# EAGLE schematic ProtoPass (EAGLE 9.0.1)
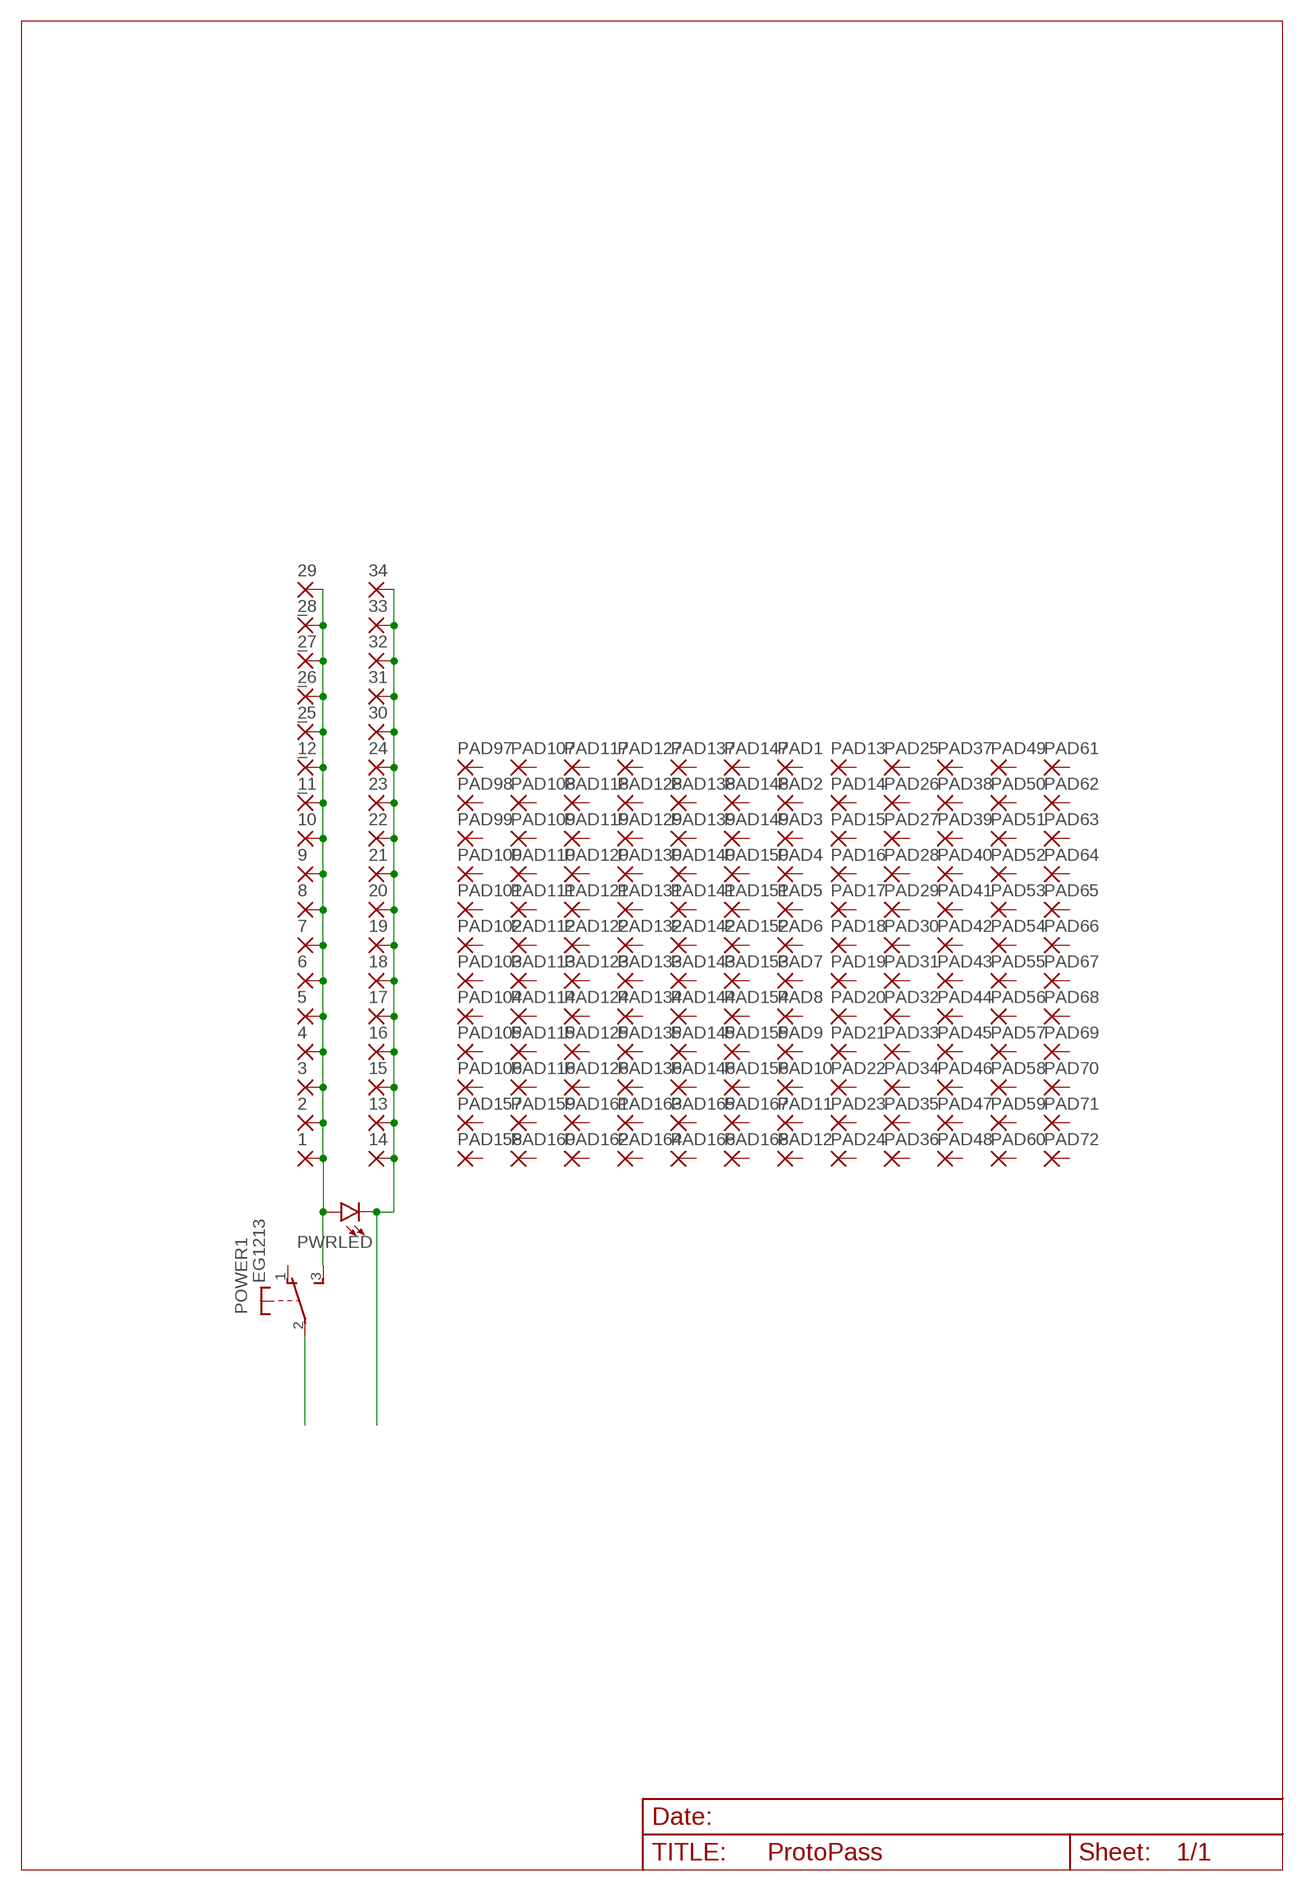
[diagram p0: schematic, sheet 1]

## Parts
1  1,6/0,9  [1,6/0,9]
2  1,6/0,9  [1,6/0,9]
3  1,6/0,9  [1,6/0,9]
4  1,6/0,9  [1,6/0,9]
5  1,6/0,9  [1,6/0,9]
6  1,6/0,9  [1,6/0,9]
7  1,6/0,9  [1,6/0,9]
8  1,6/0,9  [1,6/0,9]
9  1,6/0,9  [1,6/0,9]
10  1,6/0,9  [1,6/0,9]
11  1,6/0,9  [1,6/0,9]
12  _  1,6/0,9  [1,6/0,9]
13  1,6/0,9  [1,6/0,9]
14  1,6/0,9  [1,6/0,9]
15  1,6/0,9  [1,6/0,9]
16  1,6/0,9  [1,6/0,9]
17  1,6/0,9  [1,6/0,9]
18  1,6/0,9  [1,6/0,9]
19  1,6/0,9  [1,6/0,9]
20  1,6/0,9  [1,6/0,9]
21  1,6/0,9  [1,6/0,9]
22  1,6/0,9  [1,6/0,9]
23  1,6/0,9  [1,6/0,9]
24  1,6/0,9  [1,6/0,9]
25  _  1,6/0,9  [1,6/0,9]
26  _  1,6/0,9  [1,6/0,9]
27  _  1,6/0,9  [1,6/0,9]
28  _  1,6/0,9  [1,6/0,9]
29  _  1,6/0,9  [1,6/0,9]
30  1,6/0,9  [1,6/0,9]
31  1,6/0,9  [1,6/0,9]
32  1,6/0,9  [1,6/0,9]
33  1,6/0,9  [1,6/0,9]
34  1,6/0,9  [1,6/0,9]
PAD1  1,6/0,9  [1,6/0,9]
PAD2  1,6/0,9  [1,6/0,9]
PAD3  1,6/0,9  [1,6/0,9]
PAD4  1,6/0,9  [1,6/0,9]
PAD5  1,6/0,9  [1,6/0,9]
PAD6  1,6/0,9  [1,6/0,9]
PAD7  1,6/0,9  [1,6/0,9]
PAD8  1,6/0,9  [1,6/0,9]
PAD9  1,6/0,9  [1,6/0,9]
PAD10  1,6/0,9  [1,6/0,9]
PAD11  1,6/0,9  [1,6/0,9]
PAD12  1,6/0,9  [1,6/0,9]
PAD13  1,6/0,9  [1,6/0,9]
PAD14  1,6/0,9  [1,6/0,9]
PAD15  1,6/0,9  [1,6/0,9]
PAD16  1,6/0,9  [1,6/0,9]
PAD17  1,6/0,9  [1,6/0,9]
PAD18  1,6/0,9  [1,6/0,9]
PAD19  1,6/0,9  [1,6/0,9]
PAD20  1,6/0,9  [1,6/0,9]
PAD21  1,6/0,9  [1,6/0,9]
PAD22  1,6/0,9  [1,6/0,9]
PAD23  1,6/0,9  [1,6/0,9]
PAD24  1,6/0,9  [1,6/0,9]
PAD25  1,6/0,9  [1,6/0,9]
PAD26  1,6/0,9  [1,6/0,9]
PAD27  1,6/0,9  [1,6/0,9]
PAD28  1,6/0,9  [1,6/0,9]
PAD29  1,6/0,9  [1,6/0,9]
PAD30  1,6/0,9  [1,6/0,9]
PAD31  1,6/0,9  [1,6/0,9]
PAD32  1,6/0,9  [1,6/0,9]
PAD33  1,6/0,9  [1,6/0,9]
PAD34  1,6/0,9  [1,6/0,9]
PAD35  1,6/0,9  [1,6/0,9]
PAD36  1,6/0,9  [1,6/0,9]
PAD37  1,6/0,9  [1,6/0,9]
PAD38  1,6/0,9  [1,6/0,9]
PAD39  1,6/0,9  [1,6/0,9]
PAD40  1,6/0,9  [1,6/0,9]
PAD41  1,6/0,9  [1,6/0,9]
PAD42  1,6/0,9  [1,6/0,9]
PAD43  1,6/0,9  [1,6/0,9]
PAD44  1,6/0,9  [1,6/0,9]
PAD45  1,6/0,9  [1,6/0,9]
PAD46  1,6/0,9  [1,6/0,9]
PAD47  1,6/0,9  [1,6/0,9]
PAD48  1,6/0,9  [1,6/0,9]
PAD49  1,6/0,9  [1,6/0,9]
PAD50  1,6/0,9  [1,6/0,9]
PAD51  1,6/0,9  [1,6/0,9]
PAD52  1,6/0,9  [1,6/0,9]
PAD53  1,6/0,9  [1,6/0,9]
PAD54  1,6/0,9  [1,6/0,9]
PAD55  1,6/0,9  [1,6/0,9]
PAD56  1,6/0,9  [1,6/0,9]
PAD57  1,6/0,9  [1,6/0,9]
PAD58  1,6/0,9  [1,6/0,9]
PAD59  1,6/0,9  [1,6/0,9]
PAD60  1,6/0,9  [1,6/0,9]
PAD61  1,6/0,9  [1,6/0,9]
PAD62  1,6/0,9  [1,6/0,9]
PAD63  1,6/0,9  [1,6/0,9]
PAD64  1,6/0,9  [1,6/0,9]
PAD65  1,6/0,9  [1,6/0,9]
PAD66  1,6/0,9  [1,6/0,9]
PAD67  1,6/0,9  [1,6/0,9]
PAD68  1,6/0,9  [1,6/0,9]
PAD69  1,6/0,9  [1,6/0,9]
PAD70  1,6/0,9  [1,6/0,9]
PAD71  1,6/0,9  [1,6/0,9]
PAD72  1,6/0,9  [1,6/0,9]
PAD97  1,6/0,9  [1,6/0,9]
PAD98  1,6/0,9  [1,6/0,9]
PAD99  1,6/0,9  [1,6/0,9]
PAD100  1,6/0,9  [1,6/0,9]
PAD101  1,6/0,9  [1,6/0,9]
PAD102  1,6/0,9  [1,6/0,9]
PAD103  1,6/0,9  [1,6/0,9]
PAD104  1,6/0,9  [1,6/0,9]
PAD105  1,6/0,9  [1,6/0,9]
PAD106  1,6/0,9  [1,6/0,9]
PAD107  1,6/0,9  [1,6/0,9]
PAD108  1,6/0,9  [1,6/0,9]
PAD109  1,6/0,9  [1,6/0,9]
PAD110  1,6/0,9  [1,6/0,9]
PAD111  1,6/0,9  [1,6/0,9]
PAD112  1,6/0,9  [1,6/0,9]
PAD113  1,6/0,9  [1,6/0,9]
PAD114  1,6/0,9  [1,6/0,9]
PAD115  1,6/0,9  [1,6/0,9]
PAD116  1,6/0,9  [1,6/0,9]
PAD117  1,6/0,9  [1,6/0,9]
PAD118  1,6/0,9  [1,6/0,9]
PAD119  1,6/0,9  [1,6/0,9]
PAD120  1,6/0,9  [1,6/0,9]
PAD121  1,6/0,9  [1,6/0,9]
PAD122  1,6/0,9  [1,6/0,9]
PAD123  1,6/0,9  [1,6/0,9]
PAD124  1,6/0,9  [1,6/0,9]
PAD125  1,6/0,9  [1,6/0,9]
PAD126  1,6/0,9  [1,6/0,9]
PAD127  1,6/0,9  [1,6/0,9]
PAD128  1,6/0,9  [1,6/0,9]
PAD129  1,6/0,9  [1,6/0,9]
PAD130  1,6/0,9  [1,6/0,9]
PAD131  1,6/0,9  [1,6/0,9]
PAD132  1,6/0,9  [1,6/0,9]
PAD133  1,6/0,9  [1,6/0,9]
PAD134  1,6/0,9  [1,6/0,9]
PAD135  1,6/0,9  [1,6/0,9]
PAD136  1,6/0,9  [1,6/0,9]
PAD137  1,6/0,9  [1,6/0,9]
PAD138  1,6/0,9  [1,6/0,9]
PAD139  1,6/0,9  [1,6/0,9]
PAD140  1,6/0,9  [1,6/0,9]
PAD141  1,6/0,9  [1,6/0,9]
PAD142  1,6/0,9  [1,6/0,9]
PAD143  1,6/0,9  [1,6/0,9]
PAD144  1,6/0,9  [1,6/0,9]
PAD145  1,6/0,9  [1,6/0,9]
PAD146  1,6/0,9  [1,6/0,9]
PAD147  1,6/0,9  [1,6/0,9]
PAD148  1,6/0,9  [1,6/0,9]
PAD149  1,6/0,9  [1,6/0,9]
PAD150  1,6/0,9  [1,6/0,9]
PAD151  1,6/0,9  [1,6/0,9]
PAD152  1,6/0,9  [1,6/0,9]
PAD153  1,6/0,9  [1,6/0,9]
PAD154  1,6/0,9  [1,6/0,9]
PAD155  1,6/0,9  [1,6/0,9]
PAD156  1,6/0,9  [1,6/0,9]
PAD157  1,6/0,9  [1,6/0,9]
PAD158  1,6/0,9  [1,6/0,9]
PAD159  1,6/0,9  [1,6/0,9]
PAD160  1,6/0,9  [1,6/0,9]
PAD161  1,6/0,9  [1,6/0,9]
PAD162  1,6/0,9  [1,6/0,9]
PAD163  1,6/0,9  [1,6/0,9]
PAD164  1,6/0,9  [1,6/0,9]
PAD165  1,6/0,9  [1,6/0,9]
PAD166  1,6/0,9  [1,6/0,9]
PAD167  1,6/0,9  [1,6/0,9]
PAD168  1,6/0,9  [1,6/0,9]
POWER  EG1213  [EG1213]
PWRLED  LED5MM  [LED_5MM]

## Nets
N$1: 13.1(P) 14.1(P) 15.1(P) 16.1(P) 17.1(P) 18.1(P) 19.1(P) 20.1(P) 21.1(P) 22.1(P) 23.1(P) 24.1(P) 30.1(P) 31.1(P) 32.1(P) 33.1(P) 34.1(P) PWRLED.K(C)
N$2: POWER.2(1:P)
N$4: 1.1(P) 2.1(P) 3.1(P) 4.1(P) 5.1(P) 6.1(P) 7.1(P) 8.1(P) 9.1(P) 10.1(P) 11.1(P) 12.1(P) 25.1(P) 26.1(P) 27.1(P) 28.1(P) 29.1(P) POWER.3(1:S) PWRLED.A
Unconnected: PAD1.1(P) PAD2.1(P) PAD3.1(P) PAD4.1(P) PAD5.1(P) PAD6.1(P) PAD7.1(P) PAD8.1(P) PAD9.1(P) PAD10.1(P) PAD11.1(P) PAD12.1(P) PAD13.1(P) PAD14.1(P) PAD15.1(P) PAD16.1(P) PAD17.1(P) PAD18.1(P) PAD19.1(P) PAD20.1(P) PAD21.1(P) PAD22.1(P) PAD23.1(P) PAD24.1(P) PAD25.1(P) PAD26.1(P) PAD27.1(P) PAD28.1(P) PAD29.1(P) PAD30.1(P) PAD31.1(P) PAD32.1(P) PAD33.1(P) PAD34.1(P) PAD35.1(P) PAD36.1(P) PAD37.1(P) PAD38.1(P) PAD39.1(P) PAD40.1(P) PAD41.1(P) PAD42.1(P) PAD43.1(P) PAD44.1(P) PAD45.1(P) PAD46.1(P) PAD47.1(P) PAD48.1(P) PAD49.1(P) PAD50.1(P) PAD51.1(P) PAD52.1(P) PAD53.1(P) PAD54.1(P) PAD55.1(P) PAD56.1(P) PAD57.1(P) PAD58.1(P) PAD59.1(P) PAD60.1(P) PAD61.1(P) PAD62.1(P) PAD63.1(P) PAD64.1(P) PAD65.1(P) PAD66.1(P) PAD67.1(P) PAD68.1(P) PAD69.1(P) PAD70.1(P) PAD71.1(P) PAD72.1(P) PAD97.1(P) PAD98.1(P) PAD99.1(P) PAD100.1(P) PAD101.1(P) PAD102.1(P) PAD103.1(P) PAD104.1(P) PAD105.1(P) PAD106.1(P) PAD107.1(P) PAD108.1(P) PAD109.1(P) PAD110.1(P) PAD111.1(P) PAD112.1(P) PAD113.1(P) PAD114.1(P) PAD115.1(P) PAD116.1(P) PAD117.1(P) PAD118.1(P) PAD119.1(P) PAD120.1(P) PAD121.1(P) PAD122.1(P) PAD123.1(P) PAD124.1(P) PAD125.1(P) PAD126.1(P) PAD127.1(P) PAD128.1(P) PAD129.1(P) PAD130.1(P) PAD131.1(P) PAD132.1(P) PAD133.1(P) PAD134.1(P) PAD135.1(P) PAD136.1(P) PAD137.1(P) PAD138.1(P) PAD139.1(P) PAD140.1(P) PAD141.1(P) PAD142.1(P) PAD143.1(P) PAD144.1(P) PAD145.1(P) PAD146.1(P) PAD147.1(P) PAD148.1(P) PAD149.1(P) PAD150.1(P) PAD151.1(P) PAD152.1(P) PAD153.1(P) PAD154.1(P) PAD155.1(P) PAD156.1(P) PAD157.1(P) PAD158.1(P) PAD159.1(P) PAD160.1(P) PAD161.1(P) PAD162.1(P) PAD163.1(P) PAD164.1(P) PAD165.1(P) PAD166.1(P) PAD167.1(P) PAD168.1(P) POWER.1(1:O) POWER.MT1(MT) POWER.MT2(MT)

## Library data of the parts
1-34 PAD1-PAD72 PAD97-PAD168 = wirepad:1,6/0,9: THROUGH-HOLE PAD
POWER = adafruit:EG1213: E-Switch right-angle slide SPDT Part #EG1213 http://www.ladyada.net/library/eagle
PWRLED = SparkFun-LED:LED: LED (Generic) Standard schematic elements and footprints for 5mm, 3mm, 1206, and 0603 sized LEDs. Generic LEDs with no color specified.